# Altium schematic sheet Optocoupler-Isolation.SchDoc
size A; SheetNumber: 7; SheetTotal: 8
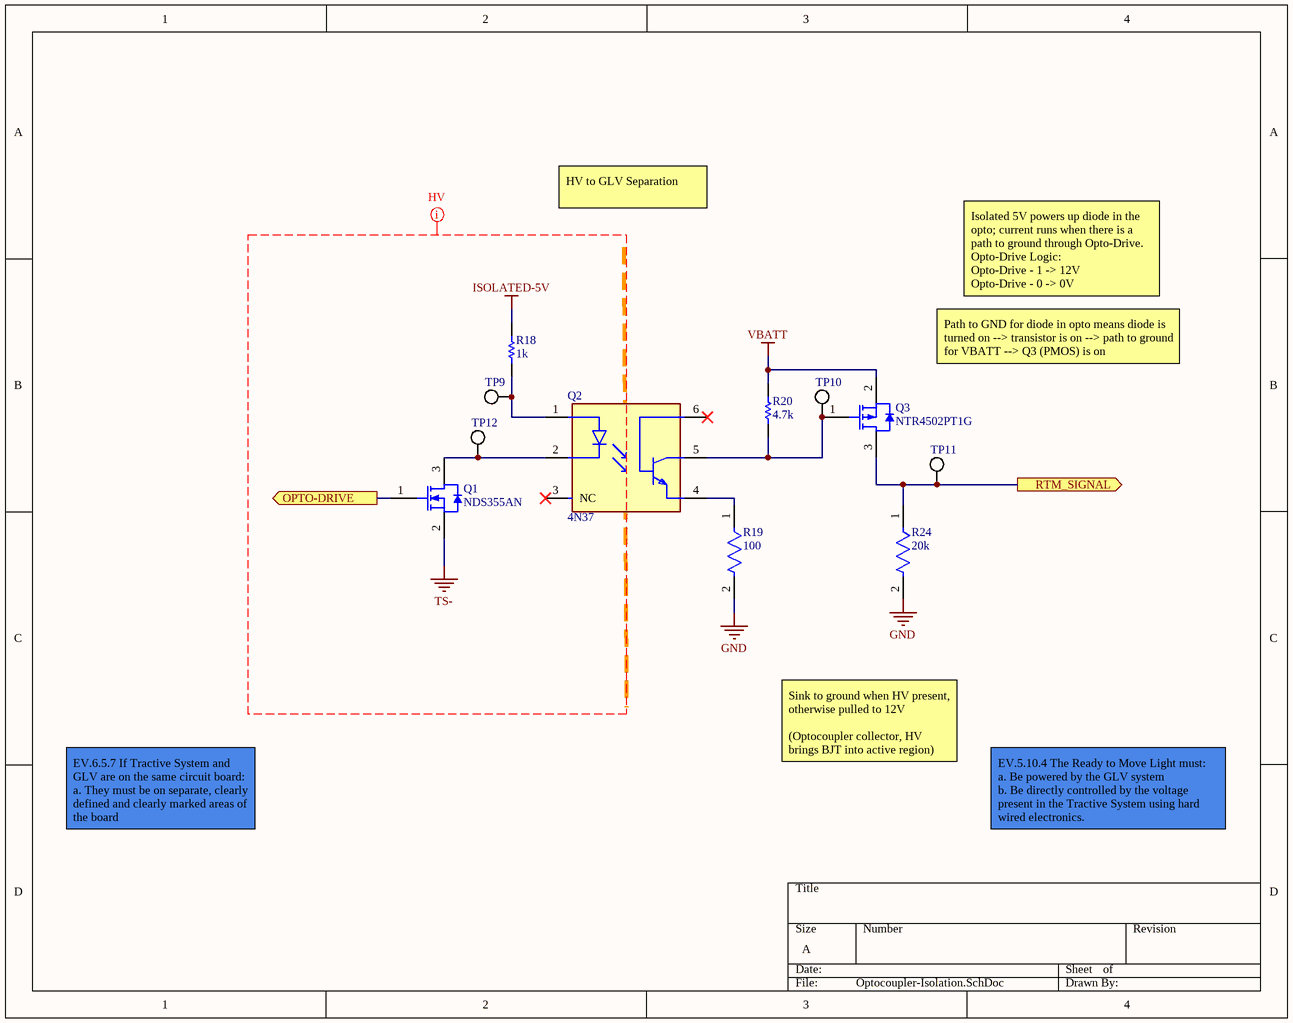
[diagram p0: Optocoupler-Isolation.SchDoc]

## Parts
Q1  NDS355AN  [FAIR-SOT-3_V]
Q2  4N37  [FP-4N37-MFG]
Q3  NTR4502PT1G  [ONSC-SOT-23-3-318-08_V]
R18  1k  [RESC3225X70X50NL20T20]
R19  100  [FP-CRCW1206-e3-MFG]
R20  4.7k  [RESC3216X60X45ML15T20]
R24  20k  [FP-CRCW1206-e3-MFG]
TP9  (no value)  [FOOTPRINT-GENERIC-TP-VIA-1MM]
TP10  (no value)  [FOOTPRINT-GENERIC-TP-VIA-1MM]
TP11  (no value)  [FOOTPRINT-GENERIC-TP-VIA-1MM]
TP12  (no value)  [FOOTPRINT-GENERIC-TP-VIA-1MM]

## Ports
OPTO-DRIVE (out, see Top_Level[2B], HV-Trigger[4B]), RTM_SIGNAL (out, see Top_Level[3B], GLV-Connectors[2B])

## Nets
GND: R19.2 R24.2
ISOLATED-5V: R18.1
TS-: Q1.2(S)
VBATT: Q3.2(S) R20.2
OPTO-DRIVE: Q1.1(G) ; port OPTO-DRIVE
RTM_SIGNAL: Q3.3(D) R24.1 TP11.1(TP) ; port RTM_SIGNAL
NetQ1_3: Q1.3(D) Q2.2(C) TP12.1(TP)
NetQ2_1: Q2.1(A) R18.2 TP9.1(TP)
NetQ2_4: Q2.4(E) R19.1
NetQ2_5: Q2.5(C) Q3.1(G) R20.1 TP10.1(TP)

Not connected (* = marked no-connect by the designer): Q2 3(NC)* 6(B)*

## Layout directives
mark named HV: ISOLATED-5V, TS-

## Notes on the sheet
- HV to GLV Separation
- Isolated 5V powers up diode in the opto; current runs when there is a path to ground through Opto-Drive. Opto-Drive Logic:                                       Opto-Drive - 1 -> 12V               Opto-Drive - 0 -> 0V
- Path to GND for diode in opto means diode is turned on --> transistor is on --> path to ground for VBATT --> Q3 (PMOS) is on
- Sink to ground when HV present, otherwise pulled to 12V
  (Optocoupler collector, HV brings BJT into active region)
- EV.6.5.7 If Tractive System and GLV are on the same circuit board:                       a. They must be on separate, clearly defined and clearly marked areas of the board
- EV.5.10.4 The Ready to Move Light must:
  a. Be powered by the GLV system
  b. Be directly controlled by the voltage present in the Tractive System using hard wired electronics.

## Library data of the parts
Q1 = CMP-2000-06834-1: N-Channel Logic Level Enhancement Mode Field Effect Transistor, 30 V, 1.7 A, -55 to150 degC, 3-Pin SOT-3, RoHS, Tape and Reel; Manufacturer: FairchildSemiconductor; Maximum Drain Source Voltage: 30V; RDS-on: 85@10VmOhm; Typical Fall Time: 5ns; Typical Rise Time: 32ns; Typical Turn-On Delay Time: 10ns; Channel Type: N; Typical Turn-Off Delay Time: 13ns; Maximum Gate Source Voltage: ±20V; Maximum Continuous Drain Current: 1.7A; Package URL: https://www.fairchildsemi.com/package-drawings/MA/MA03B.pdf; Packaging: Tape&Reel; Category: MOSFET; Mounting Technology: SurfaceMount; Datasheet Version: 01/1997; Datasheet URL: https://www.fairchildsemi.com/datasheets/ND/NDS355AN.pdf; Channel Mode: Enhancement; Package Description: 3-Pin Small Outline Transistor, Body 2.92 x 1.4 mm, Pitch 0.95 mm; Package: 3SuperSOT; Operating Temperature: -55to150°C; Package Reference: SOT-3; Manufacturer URL: https://www.fairchildsemi.com/; Mounting: SurfaceMount
Q2 = CMP-2000-05615-2: NexarPartId: 55433899; Collector Emitter Breakdown Voltage: 30V; Rise Time: 10µs; Approvals: BSI, FIMKO, UL; Reverse Breakdown Voltage: 6V; Voltage Rating (DC): 1.3V; Forward Voltage: 1.5V; Forward Current: 50mA; Isolation Voltage: 5kV; Max Power Dissipation: 70mW; Number of Channels: 1; Current Transfer Ratio: 50%; Max Collector Current: 100mA; Input Current: 10mA; Radiation Hardening: No; Case/Package: PDIP; Max Output Voltage: 30V; RoHS: Compliant; Output Voltage: 30V; REACH SVHC: Unknown; Lead Free: Lead Free; Max Input Current: 50mA; Mount: Through Hole; Max Operating Temperature: 100°C; Power Dissipation: 70mW; Collector Emitter Voltage (VCEO): 30V; Number of Elements: 1; Min Operating Temperature: -55°C; Fall Time: 10µs; Schedule B: 8541408000, 8541408000; Number of Pins: 6; Output Current per Channel: 50mA
Q3 = CMP-1058-00734-1: Power MOSFET, -30 V, -1.95 A, Single, P-Channel, 3-Pin SOT-23, Pb-Free, Tape and Reel; Manufacturer: On Semiconductor; VGS(th) Max (V): 3; Crss Typ (pF): 50; ID Max (A): 1.95; Ciss Typ (pF): 200; Coss Typ (pF): 80; Channel Polarity: P Channel; V(BR)DSS Min (V): 30; VGS Max (V): 20; PackageReference: SOT-23-3-318-08; Mounting Technology: Surface Mount; RoHS: Pb-Free; PartNumber: NTR4502PT1G; DatasheetVersion: Rev. 5; ComponentLink3URL: http://www.onsemi.cn/pub_link/Collateral/318-08.PDF; PackageDescription: 3-Pin Small Outline Transistor, Body 2.92 x 1.3 mm, Pitch 0.95 mm; ComponentLink1Description: Manufacturer URL; ComponentLink3Description: Package Specification; ComponentLink2Description: Datasheet; ComponentLink1URL: http://www.onsemi.com/; ComponentLink2URL: http://www.onsemi.cn/pub_link/Collateral/NTR4502P-D.PDF; Configuration: Single; PackageVersion: Rev. AP, 11/2009; Packing: Tape and Reel; Package Type: SOT-23-3
R18 = CMP-2005-01957-1: 360 Ohms ±1% 0.333W, 1/3W, FOOTPRINT-1210-GENERIC; Part Number: KTR25JZPF3600
R19 = CMP-2003-04801-2: RES Thick Film, 100Ω, 1%, 0.25W, 100ppm/°C, 1206; Voltage Rating (DC): 200V; Resistance: 100R; Power Rating: 250mW; Case Code (Metric): 3216; Radiation Hardening: No; Height: 0.55mm; Packaging: Tape and Reel; Depth: 1.6mm; Weight: 0.000353oz; Termination: SMD/SMT; Lead Free: Lead Free; Min Operating Temperature: -55°C; Contact Plating: Tin; Max Operating Temperature: 155°C; Case Code (Imperial): 1206; Military Standard: Not; Width: 1.6mm; Number of Pins: 2; Voltage Rating: 200V; Composition: Thick Film; Package Quantity: 5000; Tolerance: 1%; Case/Package: 1206; Mount: Surface Mount; Length: 3.2mm; Temperature Coefficient: 100ppm/°C
R20 = CMP-2100-03618-1: Chip Resistor, 4.7 KOhm, +/- 1%, 0.25 W, -55 to 155 degC, 1206 (3216 Metric), RoHS, Tape and Reel; Manufacturer: Vishay Semiconductor; Power Rating: 250mW; Voltage Rating: 200V; Temperature Coefficient: 100ppm/degreesC; Package Quantity: 10; Composition: ThickFilm; REACH SVHC: Unknown; Mount: SurfaceMount; Max Operating Temperature: 155degC; Length: 3.2mm; Number of Terminations: 2; Case Code (Metric): 3216; Military Standard: Not; Width: 1.6mm; Datasheet Version: 41061.0; Max Power Dissipation: 250mW; Datasheet URL: http://www.vishay.com/docs/20035/dcrcwe3.pdf; Contact Plating: Tin; Case/Package: 1206; Height: 0.55mm; Package Reference: 1206.0; Lead Free: LeadFree; Weight: 0.000353oz; Package Description: 2-Pin Surface Mount Device, Body 3.15 x 1.6 mm; Min Operating Temperature: -55degC; Resistance: 4.7KOhm; Packaging: TapeandReel; Depth: 1.6mm; Tolerance: 1%; RoHSCompliant: true; Termination: SMD/SMT; Case Code (Imperial): 1206; Voltage Rating (DC): 200V; Radiation Hardening: No; Manufacturer URL: http://www.vishay.com/
R24 = CMP-2003-01940-2: RES Thick Film, 20kΩ, 1%, 0.25W, 100ppm/°C, 1206; Power Rating: 250mW; Voltage Rating (DC): 200V; Resistance: 20kR; Length: 3.2mm; Case Code (Metric): 3216; Temperature Coefficient: 100ppm/°C; Height: 0.55mm; Max Power Dissipation: 250mW; Case/Package: 1206; Package Quantity: 10; Case Code (Imperial): 1206; Tolerance: 1%; Min Operating Temperature: -55°C; Width: 0.063inch; Max Operating Temperature: 155°C; Radiation Hardening: No; Composition: Thick Film; Lead Free: Lead Free; Military Standard: Not; Packaging: Tape and Reel; Voltage Rating: 200V; Depth: 1.6mm; Features: Automotive AEC-Q200; Weight: 0.000353oz; Working Voltage: 200V; Mount: Surface Mount; Contact Plating: Tin; Termination: SMD/SMT; Number of Pins: 2; Number of Terminations: 2
TP9-TP12 = CMP-025-000000-1: Source: Generic.SchLib; Design Item ID: Misc-Generic-TP